# Altium schematic sheet BW1097_Power_Supply.SchDoc: =project_title (part 2 of 3)
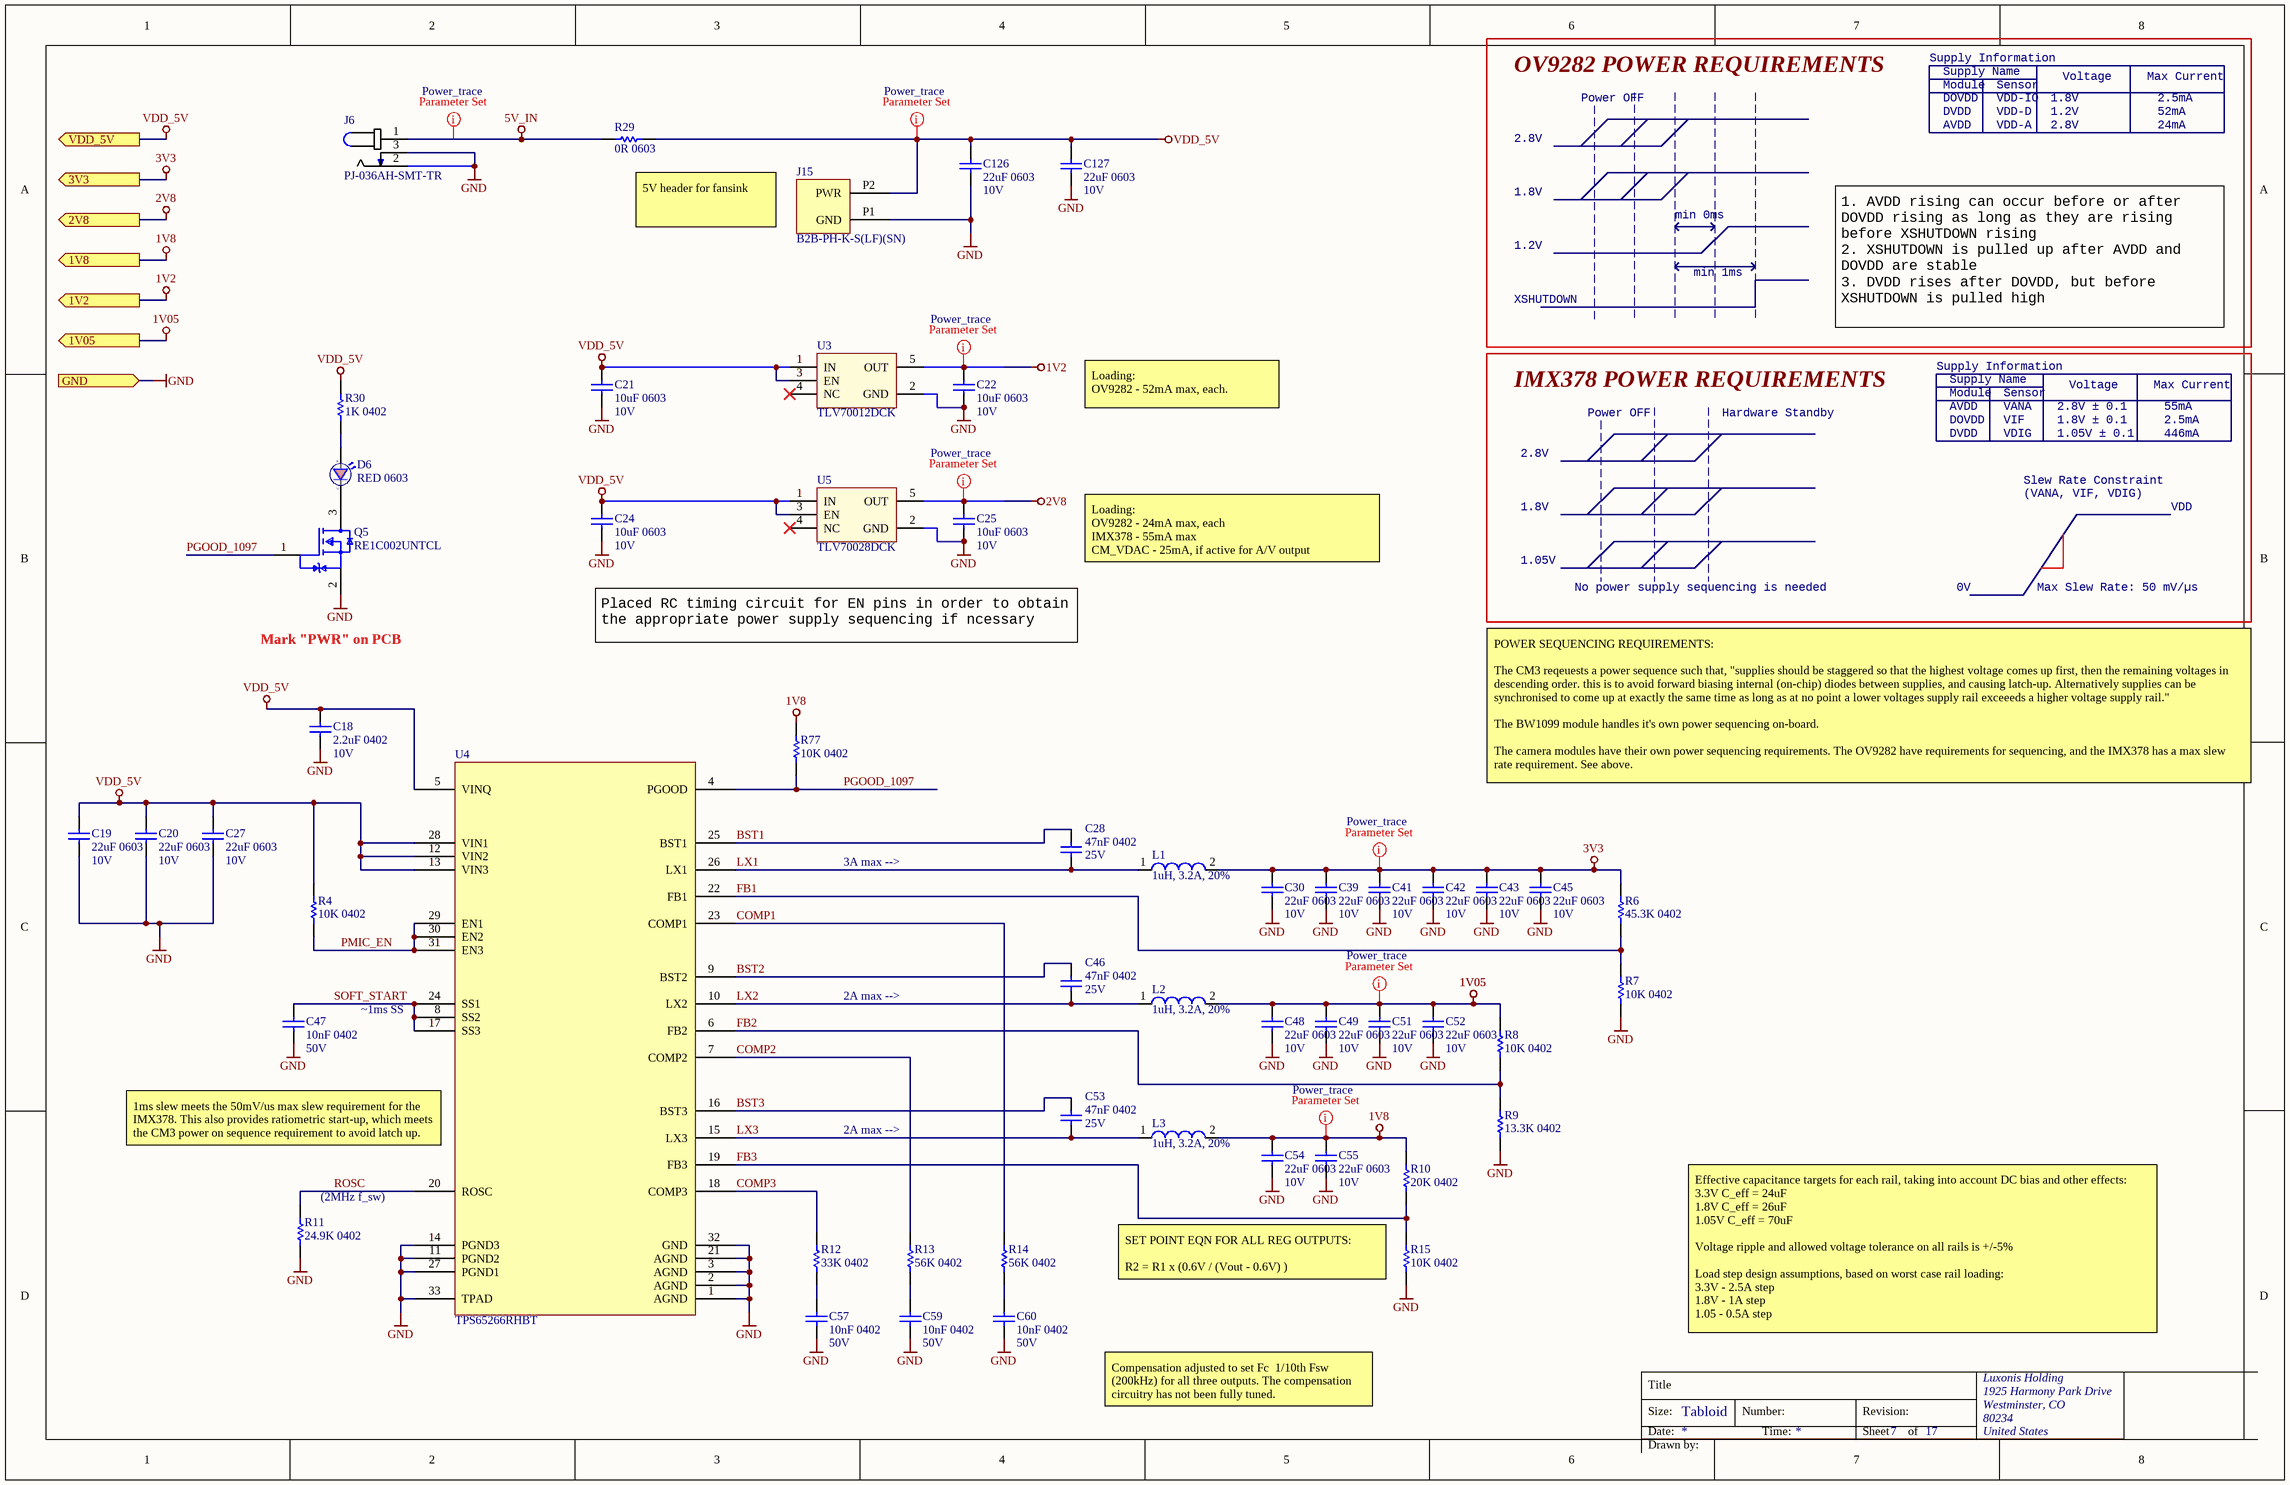
[diagram p1: BW1097_Power_Supply.SchDoc]
## Library data of the parts
C18 = GRM155R61A225KE95D: CAP CER 2.2UF 10V X5R 0402 10%; Manufacturer 1: Murata; Material: Ceramic; Manufacturer Part Number 1: GRM155R61A225KE95D; Supplier 1: Digi-Key; Stock 1: 1453518; Pricing 1: 1=0.13000, 10=0.09000, 100=0.04250, 500=0.02982, 1000=0.02469, 2500=0.02298, 5000=0.02103 (USD); RoHS: Yes; Mount: Surface Mount; Case/Package: 0402; Weight: 0.000212oz; Case Code (Metric): 1005; Case Code (Imperial): 0402; Min Operating Temperature: -55°C; Max Operating Temperature: 85°C; Capacitance: 2.2uF; Tolerance: 10%; Packaging: Tape and Reel; Dielectric: X5R; Termination: SMD/SMT; Voltage Rating (DC): 10V; Package Quantity: 10000; Length: 1mm; Height: 0.5mm; Width: 0.5mm; Thickness: 0.022inch; Depth: 0.5mm; REACH SVHC: No SVHC; Lead Free: Lead Free; ComponentLink1URL: http://www.mouser.com/ds/2/281/c02e-2905.pdf?src-supplier=Mouser; ComponentLink1Description: http://www.mouser.com/ds/2/281/c02e-2905.pdf?src-supplier=Mouser; ComponentLink2URL: http://components.arrow.com/part/dataview/0323_04264073?src-supplier=Arrow+Europe; ComponentLink2Description: http://components.arrow.com/part/dataview/0323_04264073?src-supplier=Arrow+Europe; ComponentLink3URL: http://www.farnell.com/datasheets/1872202.pdf?src-supplier=Farnell; ComponentLink3Description: http://www.farnell.com/datasheets/1872202.pdf?src-supplier=Farnell; ComponentLink4URL: http://www.farnell.com/datasheets/2047915.pdf?src-supplier=Farnell; ComponentLink4Description: http://www.farnell.com/datasheets/2047915.pdf?src-supplier=Farnell; ComponentLink5URL: http://www.farnell.com/datasheets/1872202.pdf?src-supplier=Element14; ComponentLink5Description: http://www.farnell.com/datasheets/1872202.pdf?src-supplier=Element14; ComponentLink6URL: http://psearch.en.murata.com/capacitor/product/GRM155R61A225KE95%23.pdf?src-supplier=Avnet; ComponentLink6Description: http://psearch.en.murata.com/capacitor/product/GRM155R61A225KE95%23.pdf?src-supplier=Avnet; ComponentLink7URL: http://www.farnell.com/datasheets/2047915.pdf?src-supplier=Element14; ComponentLink7Description: http://www.farnell.com/datasheets/2047915.pdf?src-supplier=Element14; ComponentLink8URL: https://search.murata.co.jp/Ceramy/image/img/A01X/G101/ENG/GRM155R61A225KE95-01.pdf?src-supplier=Digi-Key; ComponentLink8Description: https://search.murata.co.jp/Ceramy/image/img/A01X/G101/ENG/GRM155R61A225KE95-01.pdf?src-supplier=Digi-Key; ComponentLink9URL: http://www.farnell.com/datasheets/2047915.pdf?src-supplier=Newark; ComponentLink9Description: http://www.farnell.com/datasheets/2047915.pdf?src-supplier=Newark; Supplier Part Number 1: 490-10451-1-ND
C19 C20 C27 C30 C39 C41-C43 C45 C48 C49 C51 C52 C54 C55 C126 C127 = GRM188R61A226ME15D: CAP CER 22UF 10V X5R 0603 20%; Manufacturer 1: Murata; Material: Ceramic; Manufacturer Part Number 1: GRM188R61A226ME15D; ComponentLink1URL: https://datasheet.ciiva.com/46444/1769893-46444975.pdf?src-supplier=Element14; ComponentLink1Description: https://datasheet.ciiva.com/46444/1769893-46444975.pdf?src-supplier=Element14; Supplier 1: Digi-Key; Stock 1: 984716; Pricing 1: 1=0.31000, 10=0.21500, 100=0.12160, 500=0.08584, 1000=0.07512 (USD); RoHS: Yes; Mount: Surface Mount; Case/Package: 0603; Weight: 0.000222oz; Case Code (Metric): 1608; Case Code (Imperial): 0603; Min Operating Temperature: -55°C; Max Operating Temperature: 85°C; Capacitance: 22uF; Tolerance: 20%; Packaging: Tape and Reel; Dielectric: X5R; Voltage Rating (DC): 10V; Termination: SMD/SMT; Package Quantity: 4000; Length: 1.6mm; Height: 0.8mm; Width: 0.8mm; Thickness: 0.039inch; Depth: 0.8mm; REACH SVHC: No SVHC; Lead Free: Lead Free; Supplier Part Number 1: 490-10476-1-ND
C21 C22 C24 C25 = GRM188R61A106ME69D: CAP CER 10UF 10V X5R 0603 20%; Manufacturer 1: Murata; Material: Ceramic; Manufacturer Part Number 1: GRM188R61A106ME69D; Supplier 1: Digi-Key; Stock 1: 2873098; Pricing 1: 1=0.21000, 10=0.14100, 100=0.07130, 500=0.04876, 1000=0.04313 (USD); RoHS: Yes; Mount: Surface Mount; Case/Package: 0603; Weight: 0.000222oz; Case Code (Metric): 1608; Case Code (Imperial): 0603; Min Operating Temperature: -55°C; Max Operating Temperature: 85°C; Packaging: Tape and Reel; Tolerance: 20%; Capacitance: 10uF; Dielectric: X5R; Voltage Rating (DC): 10V; Package Quantity: 4000; Termination: SMD/SMT; Length: 1.6mm; Height: 0.8mm; Width: 0.8mm; Thickness: 0.035inch; Depth: 0.8mm; REACH SVHC: Unknown; Lead Free: Lead Free; ComponentLink1URL: http://www.mouser.com/ds/2/281/c02e-2905.pdf?src-supplier=Mouser; ComponentLink1Description: http://www.mouser.com/ds/2/281/c02e-2905.pdf?src-supplier=Mouser; ComponentLink2URL: http://components.arrow.com/part/dataview/0323_06119472?src-supplier=Arrow+Europe; ComponentLink2Description: http://components.arrow.com/part/dataview/0323_06119472?src-supplier=Arrow+Europe; ComponentLink3URL: http://www.farnell.com/datasheets/2048014.pdf?src-supplier=Farnell; ComponentLink3Description: http://www.farnell.com/datasheets/2048014.pdf?src-supplier=Farnell; ComponentLink4URL: http://www.farnell.com/datasheets/1872210.pdf?src-supplier=Farnell; ComponentLink4Description: http://www.farnell.com/datasheets/1872210.pdf?src-supplier=Farnell; ComponentLink5URL: http://search.murata.co.jp/Ceramy/image/img/A01X/G101/ENG/GRM188R61A106ME69-01.pdf?src-supplier=Digi-Key; ComponentLink5Description: http://search.murata.co.jp/Ceramy/image/img/A01X/G101/ENG/GRM188R61A106ME69-01.pdf?src-supplier=Digi-Key; ComponentLink6URL: http://www.farnell.com/datasheets/1872210.pdf?src-supplier=Newark; ComponentLink6Description: http://www.farnell.com/datasheets/1872210.pdf?src-supplier=Newark; ComponentLink7URL: http://www.farnell.com/datasheets/2048014.pdf?src-supplier=Element14; ComponentLink7Description: http://www.farnell.com/datasheets/2048014.pdf?src-supplier=Element14; ComponentLink8URL: http://www.farnell.com/datasheets/2048014.pdf?src-supplier=Newark; ComponentLink8Description: http://www.farnell.com/datasheets/2048014.pdf?src-supplier=Newark; Supplier Part Number 1: 490-10475-1-ND
C28 C46 C53 = GRM155R71E473KA88D: CAP CER 0.047UF 25V X7R 0402 10%; Manufacturer 1: Murata; Material: Ceramic; Manufacturer Part Number 1: GRM155R71E473KA88D; Manufacturer: Murata; Manufacturer Part Number: GRM155R71E473KA88D; RoHS: Yes; Mount: Surface Mount; Case/Package: 0402; Number of Pins: 2; Case Code (Metric): 1005; Case Code (Imperial): 0402; Min Operating Temperature: -55°C; Max Operating Temperature: 125°C; Capacitance: 47nF; Tolerance: 10%; Packaging: Tape and Reel; Dielectric: X7R; Voltage Rating (DC): 25V; Package Quantity: 1; Termination: SMD/SMT; Voltage Rating: 25V; Length: 1mm; Height: 0.5mm; Width: 0.02inch; Depth: 0.5mm; Thickness: 0.022inch; Radiation Hardening: No; Lead Free: Lead Free; REACH SVHC: No SVHC; ComponentLink1URL: https://datasheet.ciiva.com/17455/product-17455616.pdf?src-supplier=Avnet+Europe; ComponentLink1Description: https://datasheet.ciiva.com/17455/product-17455616.pdf?src-supplier=Avnet+Europe; ComponentLink2URL: https://datasheet.ciiva.com/131/grm155r71e473ka88-01-131494.pdf?src-supplier=Digi-Key; ComponentLink2Description: https://datasheet.ciiva.com/131/grm155r71e473ka88-01-131494.pdf?src-supplier=Digi-Key; ComponentLink3URL: https://datasheet.ciiva.com/34302/1856425-34302854.pdf?src-supplier=Jameco; ComponentLink3Description: https://datasheet.ciiva.com/34302/1856425-34302854.pdf?src-supplier=Jameco; ComponentLink4URL: https://datasheet.ciiva.com/18184/getdatasheetpartid-153136-18184712.pdf?src-supplier=Verical; ComponentLink4Description: https://datasheet.ciiva.com/18184/getdatasheetpartid-153136-18184712.pdf?src-supplier=Verical; ComponentLink5URL: https://datasheet.ciiva.com/29199/454180-da-01-en-vs-kondensator-0402-29199826.pdf?src-supplier=Conrad; ComponentLink5Description: https://datasheet.ciiva.com/29199/454180-da-01-en-vs-kondensator-0402-29199826.pdf?src-supplier=Conrad; ComponentLink6URL: https://datasheet.ciiva.com/2989/product-2989395.pdf?src-supplier=Avnet; ComponentLink6Description: https://datasheet.ciiva.com/2989/product-2989395.pdf?src-supplier=Avnet; ComponentLink7URL: https://datasheet.ciiva.com/131/grm155r71e473ka88-01-131492.pdf?src-supplier=Digi-Key; ComponentLink7Description: https://datasheet.ciiva.com/131/grm155r71e473ka88-01-131492.pdf?src-supplier=Digi-Key; ComponentLink8URL: https://datasheet.ciiva.com/131/grm155r71e473ka88-01-131493.pdf?src-supplier=Digi-Key; ComponentLink8Description: https://datasheet.ciiva.com/131/grm155r71e473ka88-01-131493.pdf?src-supplier=Digi-Key; ComponentLink9URL: https://datasheet.ciiva.com/7937/608985-7937623.pdf?src-supplier=Element14; ComponentLink9Description: https://datasheet.ciiva.com/7937/608985-7937623.pdf?src-supplier=Element14; ComponentLink10URL: https://datasheet.ciiva.com/14103/grmseries-highdielectrictype-eng-14103754.pdf?src-supplier=Distrelec; ComponentLink10Description: https://datasheet.ciiva.com/14103/grmseries-highdielectrictype-eng-14103754.pdf?src-supplier=Distrelec; ComponentLink11URL: https://datasheet.ciiva.com/5424/product-5424844.pdf?src-supplier=Mouser; ComponentLink11Description: https://datasheet.ciiva.com/5424/product-5424844.pdf?src-supplier=Mouser; ComponentLink12URL: https://datasheet.ciiva.com/16213/product-16213823.pdf?src-supplier=Future+Electronics; ComponentLink12Description: https://datasheet.ciiva.com/16213/product-16213823.pdf?src-supplier=Future+Electronics; Supplier 1: Digi-Key; Stock 1: 1130633; Pricing 1: 1=0.10000, 10=0.06300, 100=0.02820, 500=0.02012, 1000=0.01581, 2500=0.01438, 5000=0.01323 (USD); Supplier Part Number 1: 490-3254-1-ND
C47 C57 C59 C60 = GRM155R71H103KA88D: CAP CER 10000PF 50V X7R 0402; Manufacturer 1: Murata; Material: Ceramic; Tolerance: 10%; Voltage: 25V; Manufacturer Part Number 1: GRM155R71H103KA88D; Supplier 1: Digi-Key; Stock 1: 6923572; Pricing 1: 1=0.10000, 10=0.03800, 100=0.01690, 500=0.01208, 1000=0.00949, 2500=0.00862, 5000=0.00794 (USD); RoHS: Yes; Mount: Surface Mount; Case/Package: 0402; Number of Pins: 2; Case Code (Metric): 1005; Case Code (Imperial): 0402; Min Operating Temperature: -55°C; Max Operating Temperature: 125°C; Capacitance: 10nF; Packaging: Tape and Reel; Termination: SMD/SMT; Voltage Rating (DC): 50V; Package Quantity: 1; Dielectric: X7R; Length: 1mm; Height: 0.5mm; Width: 0.02inch; Thickness: 0.022inch; Depth: 0.5mm; Radiation Hardening: No; REACH SVHC: No SVHC; Lead Free: Lead Free; ComponentLink1URL: https://datasheet.ciiva.com/129/product-129810.pdf?src-supplier=Digi-Key; ComponentLink1Description: https://datasheet.ciiva.com/129/product-129810.pdf?src-supplier=Digi-Key; ComponentLink2URL: https://datasheet.ciiva.com/19476/1856433-19476546.pdf?src-supplier=Jameco; ComponentLink2Description: https://datasheet.ciiva.com/19476/1856433-19476546.pdf?src-supplier=Jameco; ComponentLink3URL: https://datasheet.ciiva.com/11786/0900766b80ef921d-11786340.pdf?src-supplier=RSComponents; ComponentLink3Description: https://datasheet.ciiva.com/11786/0900766b80ef921d-11786340.pdf?src-supplier=RSComponents; ComponentLink4URL: https://datasheet.ciiva.com/18100/getdatasheetpartid-27434-18100660.pdf?src-supplier=Verical; ComponentLink4Description: https://datasheet.ciiva.com/18100/getdatasheetpartid-27434-18100660.pdf?src-supplier=Verical; ComponentLink5URL: https://datasheet.ciiva.com/22698/1747449-22698420.pdf?src-supplier=Element14; ComponentLink5Description: https://datasheet.ciiva.com/22698/1747449-22698420.pdf?src-supplier=Element14; ComponentLink6URL: https://datasheet.ciiva.com/29199/454225-da-01-en-vs-kondensator-0402-29199740.pdf?src-supplier=Conrad; ComponentLink6Description: https://datasheet.ciiva.com/29199/454225-da-01-en-vs-kondensator-0402-29199740.pdf?src-supplier=Conrad; ComponentLink7URL: https://datasheet.ciiva.com/129/grm155r71h103ka88-01-129811.pdf?src-supplier=Digi-Key; ComponentLink7Description: https://datasheet.ciiva.com/129/grm155r71h103ka88-01-129811.pdf?src-supplier=Digi-Key; ComponentLink8URL: https://datasheet.ciiva.com/129/grm155r71h103ka88-01-129812.pdf?src-supplier=Digi-Key; ComponentLink8Description: https://datasheet.ciiva.com/129/grm155r71h103ka88-01-129812.pdf?src-supplier=Digi-Key; ComponentLink9URL: https://datasheet.ciiva.com/16495/product-16495290.pdf?src-supplier=Future+Electronics; ComponentLink9Description: https://datasheet.ciiva.com/16495/product-16495290.pdf?src-supplier=Future+Electronics; ComponentLink10URL: https://datasheet.ciiva.com/5410/product-5410990.pdf?src-supplier=Mouser; ComponentLink10Description: https://datasheet.ciiva.com/5410/product-5410990.pdf?src-supplier=Mouser; Supplier 2: Mouser; Supplier 3: Arrow; Supplier Part Number 1: 490-4516-1-ND; Supplier Part Number 2: 81-GRM155R71H103KA8D; Supplier Part Number 3: GRM155R71H103KA88D
D6 = SML-D12U8WT86: LED RED DIFFUSED 0603 SMD Red 620nm LED Indication - Discrete 2.2V 0603 (1608 Metric); Manufacturer 1: Rohm; Lens Style: Rectangular,Diffused,Colorless; Forward Current: 20mA; Luminous Intensity: 63mcd; Number of LEDs: 1; Viewing Angle: 160°; Lens Color: White,Clear,Diffused; Supplier 1: Digi-Key; Stock 1: 63748; Pricing 1: 1=0.33000, 10=0.23900, 100=0.11340, 500=0.07560, 1000=0.05922 (USD); Mount: Surface Mount; Case/Package: 0603; Number of Pins: 2; Case Code (Metric): 1608; Case Code (Imperial): 0603; Min Operating Temperature: -40°C; Max Operating Temperature: 85°C; Forward Voltage: 2.2V; Packaging: Tape and Reel; Dominant Wavelength: 620nm; Wavelength: 620nm; Package Quantity: 1; Test Current: 20mA; Lens Transparency: Diffused; Length: 1.6mm; Height: 0.65mm; Width: 0.8mm; Radiation Hardening: No; REACH SVHC: No SVHC; Lead Free: Lead Free; ComponentLink1URL: https://datasheet.ciiva.com/11774/0900766b80df3ada-11774020.pdf?src-supplier=RSComponents; ComponentLink1Description: https://datasheet.ciiva.com/11774/0900766b80df3ada-11774020.pdf?src-supplier=RSComponents; ComponentLink2URL: https://datasheet.ciiva.com/2110/sml-d1-2110375.pdf?src-supplier=Digi-Key; ComponentLink2Description: https://datasheet.ciiva.com/2110/sml-d1-2110375.pdf?src-supplier=Digi-Key; ComponentLink3URL: https://datasheet.ciiva.com/2110/sml-d1-2110376.pdf?src-supplier=Digi-Key; ComponentLink3Description: https://datasheet.ciiva.com/2110/sml-d1-2110376.pdf?src-supplier=Digi-Key; ComponentLink4URL: https://datasheet.ciiva.com/2110/sml-d1-2110377.pdf?src-supplier=Digi-Key; ComponentLink4Description: https://datasheet.ciiva.com/2110/sml-d1-2110377.pdf?src-supplier=Digi-Key; ComponentLink5URL: https://datasheet.ciiva.com/9324/sml-d1-9324826.pdf?src-supplier=Avnet; ComponentLink5Description: https://datasheet.ciiva.com/9324/sml-d1-9324826.pdf?src-supplier=Avnet; RoHS: Yes; Color: Red; Illumination Color: Red; ComponentLink6URL: https://datasheet.ciiva.com/17420/sml-d1-17420939.pdf?src-supplier=Avnet+Europe; ComponentLink6Description: https://datasheet.ciiva.com/17420/sml-d1-17420939.pdf?src-supplier=Avnet+Europe; Supplier Part Number 1: 511-1580-1-ND; Manufacturer Part Number 1: SML-D12U8WT86
J6 = PJ-036AH-SMT-TR: CONN PWR JACK 2X5.5MM SOLDER; Manufacturer 1: CUI; Current Rating: 5A; Gender: Male; Shielding: Unshielded; Voltage Rating: 24V; Insulation Resistance: 100MR; Number of Conductors: 2; Supplier 1: Digi-Key; Manufacturer Part Number 1: PJ-036AH-SMT-TR; Stock 1: 14194; Pricing 1: 1=1.39000, 10=1.26100, 25=1.18400, 50=1.13260, 100=1.08110 (USD); RoHS: Yes; Mount: Surface Mount; Case/Package: SMD/SMT; Color: Black; Contact Material: Brass; Contact Plating: Silver; Housing Color: Black; Housing Material: Thermoplastic; Min Operating Temperature: -25°C; Max Operating Temperature: 85°C; Package Quantity: 1000; Termination: SMD/SMT; Connector Type: Jack; Contact Gender: Male; Packaging: Tape and Reel; Orientation: Horizontal; Lead Free: Lead Free; Flammability Rating: UL94 V-0; ComponentLink1URL: http://www.mouser.com/ds/2/670/pj-036ah-smt-516063.pdf?src-supplier=Mouser; ComponentLink1Description: http://www.mouser.com/ds/2/670/pj-036ah-smt-516063.pdf?src-supplier=Mouser; ComponentLink2URL: http://www.cui.com/Product/Resource/FuturePDF/PJ-036AH-SMT.pdf?src-supplier=Future+Electronics; ComponentLink2Description: http://www.cui.com/Product/Resource/FuturePDF/PJ-036AH-SMT.pdf?src-supplier=Future+Electronics; ComponentLink3URL: https://www.cui.com/product/resource/digikeypdf/pj-036ah-smt-tr.pdf?src-supplier=Digi-Key; ComponentLink3Description: https://www.cui.com/product/resource/digikeypdf/pj-036ah-smt-tr.pdf?src-supplier=Digi-Key; Supplier Part Number 1: CP-036AHPJCT-ND; Supplier 2: Mouser; Manufacturer 2: CUI; Manufacturer Part Number 2: PJ-036AH-SMT-TR; Stock 2: 2079; Pricing 2: 1=1.36000, 10=1.20000, 25=1.13000, 50=1.08000, 100=1.03000, 200=0.93600, 400=0.84300, 1000=0.74900, 2400=0.67900, 10000=0.67900 (USD); ComponentLink4URL: http://datasheet.octopart.com/PJ-036AH-SMT-TR-CUI-datasheet-100142517.pdf?src-supplier=CUI; ComponentLink4Description: http://datasheet.octopart.com/PJ-036AH-SMT-TR-CUI-datasheet-100142517.pdf?src-supplier=CUI; ComponentLink5URL: http://datasheet.octopart.com/PJ-036AH-SMT-TR-CUI-datasheet-103764787.pdf?src-supplier=CUI; ComponentLink5Description: http://datasheet.octopart.com/PJ-036AH-SMT-TR-CUI-datasheet-103764787.pdf?src-supplier=CUI; ComponentLink6URL: http://datasheet.octopart.com/PJ-036AH-SMT-TR-CUI-datasheet-103110338.pdf?src-supplier=Electro+Sonic; ComponentLink6Description: http://datasheet.octopart.com/PJ-036AH-SMT-TR-CUI-datasheet-103110338.pdf?src-supplier=Electro+Sonic; ComponentLink7URL: http://datasheet.octopart.com/PJ-036AH-SMT-TR-CUI-datasheet-13308170.pdf?src-supplier=Future+Electronics; ComponentLink7Description: http://datasheet.octopart.com/PJ-036AH-SMT-TR-CUI-datasheet-13308170.pdf?src-supplier=Future+Electronics; ComponentLink8URL: http://datasheet.octopart.com/PJ-036AH-SMT-TR-CUI-datasheet-98439734.pdf?src-supplier=Future+Electronics; ComponentLink8Description: http://datasheet.octopart.com/PJ-036AH-SMT-TR-CUI-datasheet-98439734.pdf?src-supplier=Future+Electronics; ComponentLink9URL: http://datasheet.octopart.com/PJ-036AH-SMT-TR-CUI-datasheet-100337374.pdf?src-supplier=Future+Electronics; ComponentLink9Description: http://datasheet.octopart.com/PJ-036AH-SMT-TR-CUI-datasheet-100337374.pdf?src-supplier=Future+Electronics; ComponentLink10URL: http://datasheet.octopart.com/PJ-036AH-SMT-TR-CUI-datasheet-102985011.pdf?src-supplier=Future+Electronics; ComponentLink10Description: http://datasheet.octopart.com/PJ-036AH-SMT-TR-CUI-datasheet-102985011.pdf?src-supplier=Future+Electronics; Supplier Part Number 2: 490-PJ-036AH-SMT-TR
J15 = B2B-PH-K-S(LF)(SN): CONN HEADER VERT 2POS 2MM; Manufacturer 1: JST; Number of Positions: 2; Connector Type: Male Pin; Current Rating: 2A; Gender: Male; Contact Resistance: 20mR; Insulation Resistance: 1MR; Voltage Rating: 100V; Supplier 1: Digi-Key; Stock 1: 216199; Pricing 1: 1 = 0.170000, 10 = 0.162000, 100 = 0.100200, 500 = 0.082880, 1000 = 0.072520, 5000 = 0.062160, 10000 = 0.060440 (USD); RoHS: Yes; Mount: Through Hole; Number of Pins: 2; Contact Plating: Tin; Color: Natural; Contact Material: Brass; Housing Material: Polyamide; Housing Color: White; Min Operating Temperature: -25°C; Max Operating Temperature: 85°C; Number of Rows: 1; Packaging: Bulk; Termination: Solder; Fastening Type: Detent; Number of Poles: 2; Number of Contacts: 2; Orientation: Straight; Max Current Rating: 2A; Max Voltage Rating (AC): 100V; Voltage Rating (AC): 100V; Working Voltage: 100V; Max Voltage Rating (DC): 100V; Length: 5.9mm; Height: 9.4mm; Pitch: 2mm; Width: 4.5mm; Contact Mating Length: 0.13inch; Depth: 4.5mm; Lead Pitch: 2mm; Lead Free: Lead Free; REACH SVHC: No SVHC; ComponentLink1URL: https://datasheet.ciiva.com/6747/80560-6747392.pdf?src-supplier=Newark; ComponentLink1Description: https://datasheet.ciiva.com/6747/80560-6747392.pdf?src-supplier=Newark; ComponentLink2URL: https://datasheet.ciiva.com/11746/0900766b8082f551-11746676.pdf?src-supplier=RSComponents; ComponentLink2Description: https://datasheet.ciiva.com/11746/0900766b8082f551-11746676.pdf?src-supplier=RSComponents; ComponentLink3URL: https://datasheet.ciiva.com/8052/80560-8052022.pdf?src-supplier=Element14; ComponentLink3Description: https://datasheet.ciiva.com/8052/80560-8052022.pdf?src-supplier=Element14; ComponentLink4URL: https://datasheet.ciiva.com/712/eph-712442.pdf?src-supplier=Digi-Key; ComponentLink4Description: https://datasheet.ciiva.com/712/eph-712442.pdf?src-supplier=Digi-Key; ComponentLink5URL: https://datasheet.ciiva.com/16422/b2b-ph-k-slfsn-16422715.pdf?src-supplier=Future+Electronics; ComponentLink5Description: https://datasheet.ciiva.com/16422/b2b-ph-k-slfsn-16422715.pdf?src-supplier=Future+Electronics; Supplier Part Number 1: 455-1704-ND; Manufacturer Part Number 1: B2B-PH-K-S(LF)(SN)
L1-L3 = DFE252012P-1R0M=P2: FIXED IND 1UH 3.2A 42 MOHM SMD; Manufacturer 1: Murata; Core Material: Ferrite; Current Rating: 4.3A; Shielding: Shielded; Test Frequency: 1MHz; DC Resistance (DCR): 42mR; Manufacturer Part Number 1: DFE252012P-1R0M=P2; Manufacturer: Murata; Manufacturer Part Number: DFE252012P-1R0M=P2; RoHS: Yes; Mount: Surface Mount; Case/Package: 1008; Case Code (Metric): 2520; Min Operating Temperature: -40°C; Max Operating Temperature: 125°C; Packaging: Tape and Reel; Composition: Wirewound; Length: 0.098inch; Width: 0.079inch; Height - Seated (Max): 0.039inch; Depth: 2mm; ComponentLink1URL: http://www.farnell.com/datasheets/2550134.pdf?src-supplier=Farnell; ComponentLink1Description: http://www.farnell.com/datasheets/2550134.pdf?src-supplier=Farnell; ComponentLink2URL: https://www.murata.com/~/media/webrenewal/products/inductor/chip/tokoproducts/wirewoundmetalalloychiptype/m_dfe252012p.ashx?src-supplier=Digi-Key; ComponentLink2Description: https://www.murata.com/~/media/webrenewal/products/inductor/chip/tokoproducts/wirewoundmetalalloychiptype/m_dfe252012p.ashx?src-supplier=Digi-Key; ComponentLink3URL: http://www.murata.com/~/media/webrenewal/products/inductor/chip/tokoproducts/wirewoundmetalalloychiptype/m_dfe252012p.ashx?src-supplier=Digi-Key; ComponentLink3Description: http://www.murata.com/~/media/webrenewal/products/inductor/chip/tokoproducts/wirewoundmetalalloychiptype/m_dfe252012p.ashx?src-supplier=Digi-Key; ComponentLink4URL: http://www.toko.co.jp/products/pdf/inductors/dfe252012p.pdf?src-supplier=Avnet; ComponentLink4Description: http://www.toko.co.jp/products/pdf/inductors/dfe252012p.pdf?src-supplier=Avnet; Supplier 1: Digi-Key; Stock 1: 2560; Pricing 1: 1=0.43000, 10=0.37800, 100=0.27030, 500=0.22702, 1000=0.18377 (USD); Supplier Part Number 1: 490-10647-1-ND; Max DC Current: 3.2A; Tolerance: 20%; Case Code (Imperial): 1008; Supplier 2: Digi-Key; Manufacturer 2: Murata; Manufacturer Part Number 2: DFE252012P-1R0M=P2; Stock 2: 95; Pricing 2: 1=0.43000, 10=0.37800, 100=0.27030, 500=0.22702, 1000=0.18377 (USD); Supplier 3: Mouser; Manufacturer 3: Murata; Manufacturer Part Number 3: DFE252012P-1R0M=P2; Stock 3: 667; Pricing 3: 1=0.43000, 10=0.37900, 50=0.37900, 100=0.27000, 1000=0.18400, 10000=0.14600 (USD); Supplier 4: Element14; Manufacturer 4: Murata; Manufacturer Part Number 4: DFE252012P-1R0M=P2; Stock 4: 41; Pricing 4: 1=0.64000, 10=0.56500, 100=0.40500, 500=0.34000, 1000=0.27500 (SGD); Supplier Part Number 4: 2530071; Supplier Part Number 3: 81-DFE252012P-1R0MP2; Supplier Part Number 2: 490-10647-6-ND; Inductance: 1uH
Q5 = RE1C002UNTCL: MOSFET N-CH 20V 0.2A EMT3; Manufacturer 1: Rohm; Continuous Drain Current (ID): 200mA; Rds On Max: 1.2R; Input Capacitance: 25pF; Max Power Dissipation: 150mW; Manufacturer Part Number 1: RE1C002UNTCL; RoHS: Yes; Mount: Surface Mount; Case/Package: SOT-89; Packaging: Tape and Reel; Drain to Source Voltage (Vdss): 20V; Lead Free: Lead Free; ComponentLink1URL: http://www.mouser.com/ds/2/348/re1c002untcl-e-1018231.pdf?src-supplier=Mouser; ComponentLink1Description: http://www.mouser.com/ds/2/348/re1c002untcl-e-1018231.pdf?src-supplier=Mouser; ComponentLink2URL: http://rohmfs.rohm.com/en/techdata_basic/transistor/taping/EMT3_TL_taping.pdf?src-supplier=Digi-Key; ComponentLink2Description: http://rohmfs.rohm.com/en/techdata_basic/transistor/taping/EMT3_TL_taping.pdf?src-supplier=Digi-Key; ComponentLink3URL: http://rohmfs.rohm.com/en/products/databook/datasheet/discrete/transistor/mosfet/re1c002un.pdf?src-supplier=Avnet; ComponentLink3Description: http://rohmfs.rohm.com/en/products/databook/datasheet/discrete/transistor/mosfet/re1c002un.pdf?src-supplier=Avnet; ComponentLink4URL: https://www.rohm.com/datasheet/RE1C002UN/re1c002untcl-e?src-supplier=Digi-Key; ComponentLink4Description: https://www.rohm.com/datasheet/RE1C002UN/re1c002untcl-e?src-supplier=Digi-Key; ComponentLink5URL: http://www.farnell.com/datasheets/2704376.pdf?src-supplier=Newark; ComponentLink5Description: http://www.farnell.com/datasheets/2704376.pdf?src-supplier=Newark; ComponentLink6URL: http://www.farnell.com/datasheets/2704376.pdf?src-supplier=Farnell; ComponentLink6Description: http://www.farnell.com/datasheets/2704376.pdf?src-supplier=Farnell; ComponentLink7URL: http://www.farnell.com/datasheets/2704376.pdf?src-supplier=Element14; ComponentLink7Description: http://www.farnell.com/datasheets/2704376.pdf?src-supplier=Element14; Supplier 1: Digi-Key; Stock 1: 868886; Pricing 1: 1=0.20000, 10=0.18200, 100=0.09930, 500=0.06112, 1000=0.04167 (USD); Supplier Part Number 1: RE1C002UNTCLCT-ND
R4 R7 R8 R15 R77 = RC0402FR-1310KL: RES SMD 10K OHM 1% 0402 1/16W Chip Resistor, 0402 [1005 Metric], 10 kohm, RC Series, 50 V, Thick Film, 62.5 mW; Manufacturer 1: Yageo; Resistance: 10kR; Temperature Coefficient: 100ppm/°C; Power Rating: 62.5mW; Voltage Rating: 50V; Manufacturer Part Number 1: RC0402FR-1310KL; ComponentLink1URL: https://datasheet.ciiva.com/16940/pyu-rc0402-51-rohs-l-6-16940293.pdf?src-supplier=Avnet+Europe; ComponentLink1Description: https://datasheet.ciiva.com/16940/pyu-rc0402-51-rohs-l-6-16940293.pdf?src-supplier=Avnet+Europe; ComponentLink2URL: https://datasheet.ciiva.com/28386/pyu-rc0402-51-rohs-l-6-28386855.pdf?src-supplier=Avnet+Europe; ComponentLink2Description: https://datasheet.ciiva.com/28386/pyu-rc0402-51-rohs-l-6-28386855.pdf?src-supplier=Avnet+Europe; ComponentLink3URL: https://datasheet.ciiva.com/16740/pyu-rc0402-51-rohs-l-6-r-16740602.pdf?src-supplier=Future+Electronics; ComponentLink3Description: https://datasheet.ciiva.com/16740/pyu-rc0402-51-rohs-l-6-r-16740602.pdf?src-supplier=Future+Electronics; ComponentLink4URL: https://datasheet.ciiva.com/8891/pyu-rc0402-51-rohs-l-6-8891339.pdf?src-supplier=Avnet; ComponentLink4Description: https://datasheet.ciiva.com/8891/pyu-rc0402-51-rohs-l-6-8891339.pdf?src-supplier=Avnet; ComponentLink5URL: https://datasheet.ciiva.com/5557/pyu-rc0402-51-rohs-l-6-r-5557997.pdf?src-supplier=Mouser; ComponentLink5Description: https://datasheet.ciiva.com/5557/pyu-rc0402-51-rohs-l-6-r-5557997.pdf?src-supplier=Mouser; ComponentLink6URL: https://datasheet.ciiva.com/7983/1018594-7983533.pdf?src-supplier=Element14; ComponentLink6Description: https://datasheet.ciiva.com/7983/1018594-7983533.pdf?src-supplier=Element14; Supplier 1: Newark; Stock 1: 62239; Pricing 1: 1=0.10000, 25=0.01200, 100=0.00400, 250=0.00400, 500=0.00300, 1000=0.00300 (USD); RoHS: Yes; Case/Package: 0402; Number of Pins: 2; Contact Plating: Tin,Matte,Lead; Case Code (Imperial): 0402; Case Code (Metric): 1005; Min Operating Temperature: -55°C; Max Operating Temperature: 155°C; Tolerance: 1%; Composition: Thick Film; Packaging: Tape and Reel; Termination: SMD/SMT; Military Standard: Not; Voltage Rating (DC): 50V; Working Voltage: 50V; Number of Terminations: 2; Length: 1mm; Depth: 0.5mm; Radiation Hardening: No; REACH SVHC: No SVHC; Lead Free: Lead Free; Supplier Part Number 1: 67R9960; Supplier 2: Future Electronics; Supplier 3: Mouser; Supplier 4: Element14; Supplier Part Number 2: RC0402FR-1310KL-CUTT; Supplier Part Number 3: 603-RC0402FR-1310KL; Supplier Part Number 4: 1799235
R6 = RC0402FR-0745K3L: RES SMD 45.3K OHM 1% 1/16W 0402; Manufacturer 1: Yageo; Resistance: 45.3kR; Temperature Coefficient: 100ppm/°C; Power Rating: 62.5mW; Voltage Rating: 50V; Max Power Dissipation: 63mW; Manufacturer Part Number 1: RC0402FR-0745K3L; Supplier 1: Digi-Key; Stock 1: 1784936; Pricing 1: 1=0.10000, 10=0.01600, 100=0.00640, 1000=0.00289, 2500=0.00251, 5000=0.00207 (USD); RoHS: Yes; Case/Package: 0402; Case Code (Imperial): 0402; Case Code (Metric): 1005; Contact Plating: Tin,Matte; Min Operating Temperature: -55°C; Max Operating Temperature: 155°C; Tolerance: 1%; Packaging: Tape and Reel; Composition: Thick Film; Package Quantity: 1; Number of Terminations: 2; Termination: SMD/SMT; Voltage Rating (DC): 50V; Features: Moisture Resistant; Military Standard: Not; Working Voltage: 50V; Length: 1mm; Height: 0.016inch; Width: 0.5mm; Depth: 0.5mm; Lead Free: Lead Free; ComponentLink1URL: https://datasheet.ciiva.com/16857/pyu-rc0402-51-rohs-l-6-16857256.pdf?src-supplier=Avnet+Europe; ComponentLink1Description: https://datasheet.ciiva.com/16857/pyu-rc0402-51-rohs-l-6-16857256.pdf?src-supplier=Avnet+Europe; ComponentLink2URL: https://datasheet.ciiva.com/2519/pyu-r-int-thick-7-2519180.pdf?src-supplier=Digi-Key; ComponentLink2Description: https://datasheet.ciiva.com/2519/pyu-r-int-thick-7-2519180.pdf?src-supplier=Digi-Key; ComponentLink3URL: https://datasheet.ciiva.com/2519/pyu-r-int-thick-7-2519181.pdf?src-supplier=Digi-Key; ComponentLink3Description: https://datasheet.ciiva.com/2519/pyu-r-int-thick-7-2519181.pdf?src-supplier=Digi-Key; ComponentLink4URL: https://datasheet.ciiva.com/2519/pyu-r-int-thick-7-2519182.pdf?src-supplier=Digi-Key; ComponentLink4Description: https://datasheet.ciiva.com/2519/pyu-r-int-thick-7-2519182.pdf?src-supplier=Digi-Key; ComponentLink5URL: https://datasheet.ciiva.com/8889/pyu-rc0402-51-rohs-l-6-8889086.pdf?src-supplier=Avnet; ComponentLink5Description: https://datasheet.ciiva.com/8889/pyu-rc0402-51-rohs-l-6-8889086.pdf?src-supplier=Avnet; ComponentLink6URL: https://datasheet.ciiva.com/28399/pyu-rc0402-51-rohs-l-6-28399550.pdf?src-supplier=Avnet+Europe; ComponentLink6Description: https://datasheet.ciiva.com/28399/pyu-rc0402-51-rohs-l-6-28399550.pdf?src-supplier=Avnet+Europe; Supplier 2: Mouser; Supplier Part Number 1: 311-45.3KLRCT-ND; Supplier Part Number 2: 603-RC0402FR-0745K3L
R9 = RC0402FR-0713K3L: RES SMD 13.3K OHM 1% 1/16W 0402; Manufacturer 1: Yageo; Resistance: 13.3kR; Temperature Coefficient: 100ppm/°C; Power Rating: 62.5mW; Voltage Rating: 50V; Max Power Dissipation: 63mW; Manufacturer Part Number 1: RC0402FR-0713K3L; Supplier 1: Digi-Key; Stock 1: 840352; Pricing 1: 1=0.10000, 10=0.01600, 100=0.00640, 1000=0.00289, 2500=0.00251, 5000=0.00207 (USD); RoHS: Yes; Case/Package: 0402; Case Code (Imperial): 0402; Case Code (Metric): 1005; Contact Plating: Tin,Matte; Min Operating Temperature: -55°C; Max Operating Temperature: 155°C; Tolerance: 1%; Packaging: Tape and Reel; Composition: Thick Film; Number of Terminations: 2; Termination: SMD/SMT; Voltage Rating (DC): 50V; Features: Moisture Resistant; Military Standard: Not; Working Voltage: 50V; Length: 1mm; Height: 0.016inch; Width: 0.02inch; Depth: 0.5mm; Lead Free: Lead Free; ComponentLink1URL: https://datasheet.ciiva.com/16869/pyu-rc0402-51-rohs-l-6-16869878.pdf?src-supplier=Avnet+Europe; ComponentLink1Description: https://datasheet.ciiva.com/16869/pyu-rc0402-51-rohs-l-6-16869878.pdf?src-supplier=Avnet+Europe; ComponentLink2URL: https://datasheet.ciiva.com/16741/pyu-rc0402-51-rohs-l-6-r-16741079.pdf?src-supplier=Future+Electronics; ComponentLink2Description: https://datasheet.ciiva.com/16741/pyu-rc0402-51-rohs-l-6-r-16741079.pdf?src-supplier=Future+Electronics; ComponentLink3URL: https://datasheet.ciiva.com/28404/pyu-rc0402-51-rohs-l-6-28404430.pdf?src-supplier=Avnet+Europe; ComponentLink3Description: https://datasheet.ciiva.com/28404/pyu-rc0402-51-rohs-l-6-28404430.pdf?src-supplier=Avnet+Europe; ComponentLink4URL: https://datasheet.ciiva.com/12656/pyu-rc0402-51-rohs-l-6-r-12656623.pdf?src-supplier=Mouser; ComponentLink4Description: https://datasheet.ciiva.com/12656/pyu-rc0402-51-rohs-l-6-r-12656623.pdf?src-supplier=Mouser; Supplier 2: Mouser; Supplier Part Number 1: YAG2974CT-ND; Supplier Part Number 2: 603-RC0402FR-0713K3L
R10 = RC0402FR-0720KL: RES SMD 20K OHM 1% 1/16W 0402 20 kOhms ±1% 0.063W, 1/16W Chip Resistor 0402 (1005 Metric) Moisture Resistant Thick Film; Manufacturer 1: Yageo; Resistance: 20kR; Temperature Coefficient: 100ppm/°C; Power Rating: 62.5mW; Voltage Rating: 50V; Max Power Dissipation: 63mW; Manufacturer Part Number 1: RC0402FR-0720KL; Manufacturer: Yageo; Manufacturer Part Number: RC0402FR-0720KL; RoHS: Yes; Case/Package: 0402; Number of Pins: 2; Case Code (Metric): 1005; Case Code (Imperial): 0402; Min Operating Temperature: -55°C; Max Operating Temperature: 155°C; Tolerance: 1%; Packaging: Tape and Reel; Composition: Thick Film; Military Standard: Not; Number of Terminations: 2; Package Quantity: 1; Voltage Rating (DC): 50V; Termination: SMD/SMT; Features: Moisture Resistant; Length: 1mm; Height: 0.016inch; Width: 0.02inch; Depth: 0.5mm; Lead Free: Lead Free; REACH SVHC: No SVHC; ComponentLink1URL: https://datasheet.ciiva.com/11808/0900766b80c66297-11808454.pdf?src-supplier=RSComponents; ComponentLink1Description: https://datasheet.ciiva.com/11808/0900766b80c66297-11808454.pdf?src-supplier=RSComponents; ComponentLink2URL: https://datasheet.ciiva.com/2453/pyu-r-int-thick-7-2453493.pdf?src-supplier=Digi-Key; ComponentLink2Description: https://datasheet.ciiva.com/2453/pyu-r-int-thick-7-2453493.pdf?src-supplier=Digi-Key; ComponentLink3URL: https://datasheet.ciiva.com/2453/pyu-r-int-thick-7-2453494.pdf?src-supplier=Digi-Key; ComponentLink3Description: https://datasheet.ciiva.com/2453/pyu-r-int-thick-7-2453494.pdf?src-supplier=Digi-Key; ComponentLink4URL: https://datasheet.ciiva.com/2453/pyu-r-int-thick-7-2453495.pdf?src-supplier=Digi-Key; ComponentLink4Description: https://datasheet.ciiva.com/2453/pyu-r-int-thick-7-2453495.pdf?src-supplier=Digi-Key; ComponentLink5URL: https://datasheet.ciiva.com/7983/1018594-7983511.pdf?src-supplier=Element14; ComponentLink5Description: https://datasheet.ciiva.com/7983/1018594-7983511.pdf?src-supplier=Element14; ComponentLink6URL: https://datasheet.ciiva.com/12558/pyu-rc0402-51-rohs-l-6-r-8721-12558796.pdf?src-supplier=Mouser; ComponentLink6Description: https://datasheet.ciiva.com/12558/pyu-rc0402-51-rohs-l-6-r-8721-12558796.pdf?src-supplier=Mouser; ComponentLink7URL: https://datasheet.ciiva.com/46394/1018594-46394974.pdf?src-supplier=Element14; ComponentLink7Description: https://datasheet.ciiva.com/46394/1018594-46394974.pdf?src-supplier=Element14; Supplier 1: Digi-Key; Stock 1: 5326062; Pricing 1: 1=0.10000, 10=0.01600, 100=0.00670, 1000=0.00301, 2500=0.00261, 5000=0.00215 (USD); Supplier Part Number 1: 311-20.0KLRCT-ND
R11 = RC0402FR-0724K9L: RES SMD 24.9K OHM 1% 1/16W 0402; Manufacturer 1: Yageo; Resistance: 24.9kR; Temperature Coefficient: 100ppm/°C; Power Rating: 62.5mW; Voltage Rating: 50V; Max Power Dissipation: 63mW; Manufacturer Part Number 1: RC0402FR-0724K9L; Supplier 1: Digi-Key; Stock 1: 8504078; Pricing 1: 1=0.10000, 10=0.01600, 100=0.00640, 1000=0.00289, 2500=0.00251, 5000=0.00207 (USD); RoHS: Yes; Case/Package: 0402; Case Code (Metric): 1005; Case Code (Imperial): 0402; Contact Plating: Tin,Matte; Min Operating Temperature: -55°C; Max Operating Temperature: 155°C; Tolerance: 1%; Packaging: Tape and Reel; Composition: Thick Film; Package Quantity: 1; Number of Terminations: 2; Termination: SMD/SMT; Voltage Rating (DC): 50V; Features: Moisture Resistant; Military Standard: Not; Length: 1mm; Height: 0.016inch; Width: 0.02inch; Depth: 0.5mm; Lead Free: Lead Free; ComponentLink1URL: https://datasheet.ciiva.com/2519/pyu-r-int-thick-7-2519126.pdf?src-supplier=Digi-Key; ComponentLink1Description: https://datasheet.ciiva.com/2519/pyu-r-int-thick-7-2519126.pdf?src-supplier=Digi-Key; ComponentLink2URL: https://datasheet.ciiva.com/2519/pyu-r-int-thick-7-2519127.pdf?src-supplier=Digi-Key; ComponentLink2Description: https://datasheet.ciiva.com/2519/pyu-r-int-thick-7-2519127.pdf?src-supplier=Digi-Key; ComponentLink3URL: https://datasheet.ciiva.com/2519/pyu-r-int-thick-7-2519128.pdf?src-supplier=Digi-Key; ComponentLink3Description: https://datasheet.ciiva.com/2519/pyu-r-int-thick-7-2519128.pdf?src-supplier=Digi-Key; ComponentLink4URL: https://datasheet.ciiva.com/12667/pyu-rc0402-51-rohs-l-6-r-12667961.pdf?src-supplier=Mouser; ComponentLink4Description: https://datasheet.ciiva.com/12667/pyu-rc0402-51-rohs-l-6-r-12667961.pdf?src-supplier=Mouser; ComponentLink5URL: https://datasheet.ciiva.com/16868/pyu-rc0402-51-rohs-l-6-16868650.pdf?src-supplier=Avnet+Europe; ComponentLink5Description: https://datasheet.ciiva.com/16868/pyu-rc0402-51-rohs-l-6-16868650.pdf?src-supplier=Avnet+Europe; ComponentLink6URL: https://datasheet.ciiva.com/17019/pyu-rc0402-51-rohs-l-6-r-17019690.pdf?src-supplier=Future+Electronics; ComponentLink6Description: https://datasheet.ciiva.com/17019/pyu-rc0402-51-rohs-l-6-r-17019690.pdf?src-supplier=Future+Electronics; ComponentLink7URL: https://datasheet.ciiva.com/8889/pyu-rc0402-51-rohs-l-6-8889995.pdf?src-supplier=Avnet; ComponentLink7Description: https://datasheet.ciiva.com/8889/pyu-rc0402-51-rohs-l-6-8889995.pdf?src-supplier=Avnet; Supplier 2: Mouser; Supplier 3: TTI; Supplier Part Number 1: 311-24.9KLRCT-ND; Supplier Part Number 2: 603-RC0402FR-0724K9L; Supplier Part Number 3: RC0402FR-0724K9L
R12 = CRCW040233K0FKED: RES SMD 33K OHM 1% 1/16W 0402; Manufacturer 1: Vishay; Resistance: 33kR; Power Rating: 63mW; Voltage Rating: 50V; Temperature Coefficient: 100ppm/°C; Manufacturer Part Number 1: CRCW040233K0FKED; Supplier 1: Digi-Key; Stock 1: 59075; Pricing 1: 1=0.10000, 10=0.03800, 100=0.01540, 1000=0.00690, 2500=0.00599, 5000=0.00495 (USD); RoHS: Yes; Case/Package: 0402; Weight: 2.3E-05oz; Case Code (Imperial): 0402; Case Code (Metric): 1005; Min Operating Temperature: -55°C; Max Operating Temperature: 155°C; Tolerance: 1%; Packaging: Tape and Reel; Termination: SMD/SMT; Composition: Thick Film; Military Standard: Not; Voltage Rating (DC): 50V; Length: 1mm; Height: 0.35mm; Width: 0.5mm; Depth: 0.5mm; REACH SVHC: Unknown; Lead Free: Lead Free; ComponentLink1URL: https://datasheet.ciiva.com/11812/0900766b80d98824-11812191.pdf?src-supplier=RSComponents; ComponentLink1Description: https://datasheet.ciiva.com/11812/0900766b80d98824-11812191.pdf?src-supplier=RSComponents; ComponentLink2URL: https://datasheet.ciiva.com/5544/dcrcwe3-109170-5544613.pdf?src-supplier=Mouser; ComponentLink2Description: https://datasheet.ciiva.com/5544/dcrcwe3-109170-5544613.pdf?src-supplier=Mouser; ComponentLink3URL: https://datasheet.ciiva.com/22870/70201119-22870281.pdf?src-supplier=Allied+Electronics; ComponentLink3Description: https://datasheet.ciiva.com/22870/70201119-22870281.pdf?src-supplier=Allied+Electronics; Supplier 2: Newark; Supplier 3: Mouser; Supplier Part Number 1: 541-33.0KLCT-ND; Supplier Part Number 2: 26W9081; Supplier Part Number 3: 71-CRCW040233K0FKED; Mount: Surface Mount; Number of Pins: 2; Contact Plating: Tin; Package Quantity: 10; Number of Terminations: 2; Max Power Dissipation: 63mW; Features: Automotive AEC-Q200; Radiation Hardening: No; ComponentLink4URL: https://datasheet.ciiva.com/2463/dcrcwe3-2463133.pdf?src-supplier=Digi-Key; ComponentLink4Description: https://datasheet.ciiva.com/2463/dcrcwe3-2463133.pdf?src-supplier=Digi-Key; ComponentLink5URL: https://datasheet.ciiva.com/2463/dcrcwe3-2463134.pdf?src-supplier=Digi-Key; ComponentLink5Description: https://datasheet.ciiva.com/2463/dcrcwe3-2463134.pdf?src-supplier=Digi-Key; ComponentLink6URL: https://datasheet.ciiva.com/22674/1847332-22674693.pdf?src-supplier=Element14; ComponentLink6Description: https://datasheet.ciiva.com/22674/1847332-22674693.pdf?src-supplier=Element14; ComponentLink7URL: https://datasheet.ciiva.com/16200/dcrcwe3-16200566.pdf?src-supplier=Future+Electronics; ComponentLink7Description: https://datasheet.ciiva.com/16200/dcrcwe3-16200566.pdf?src-supplier=Future+Electronics; ComponentLink8URL: https://datasheet.ciiva.com/3256/dcrcwe3-3256411.pdf?src-supplier=Avnet; ComponentLink8Description: https://datasheet.ciiva.com/3256/dcrcwe3-3256411.pdf?src-supplier=Avnet; ComponentLink9URL: https://datasheet.ciiva.com/3256/dcrcwe3-3256412.pdf?src-supplier=Avnet; ComponentLink9Description: https://datasheet.ciiva.com/3256/dcrcwe3-3256412.pdf?src-supplier=Avnet; ComponentLink10URL: https://datasheet.ciiva.com/2463/dcrcwe3-2463135.pdf?src-supplier=Digi-Key; ComponentLink10Description: https://datasheet.ciiva.com/2463/dcrcwe3-2463135.pdf?src-supplier=Digi-Key; ComponentLink11URL: https://datasheet.ciiva.com/16772/70201119-16772031.pdf?src-supplier=Allied+Electronics; ComponentLink11Description: https://datasheet.ciiva.com/16772/70201119-16772031.pdf?src-supplier=Allied+Electronics; ComponentLink12URL: https://datasheet.ciiva.com/22704/1697337-22704431.pdf?src-supplier=Element14; ComponentLink12Description: https://datasheet.ciiva.com/22704/1697337-22704431.pdf?src-supplier=Element14
R13 R14 = RC0402FR-0756KL: RES SMD 56K OHM 1% 1/16W 0402 56 kOhms ±1% 0.063W, 1/16W Chip Resistor 0402 (1005 Metric) Moisture Resistant Thick Film; Manufacturer 1: Yageo; Resistance: 56kR; Temperature Coefficient: 100ppm/°C; Power Rating: 62.5mW; Voltage Rating: 50V; Max Power Dissipation: 63mW; Manufacturer Part Number 1: RC0402FR-0756KL; Manufacturer: Yageo; Manufacturer Part Number: RC0402FR-0756KL; RoHS: Yes; Case/Package: 0402; Case Code (Metric): 1005; Case Code (Imperial): 0402; Min Operating Temperature: -55°C; Max Operating Temperature: 155°C; Tolerance: 1%; Packaging: Tape and Reel; Composition: Thick Film; Package Quantity: 1; Number of Terminations: 2; Termination: SMD/SMT; Military Standard: Not; Features: Moisture Resistant; Working Voltage: 50V; Length: 1mm; Height: 0.016inch; Width: 0.02inch; Depth: 0.5mm; Lead Free: Lead Free; REACH SVHC: No SVHC; ComponentLink1URL: https://datasheet.ciiva.com/2453/pyu-r-int-thick-7-2453478.pdf?src-supplier=Digi-Key; ComponentLink1Description: https://datasheet.ciiva.com/2453/pyu-r-int-thick-7-2453478.pdf?src-supplier=Digi-Key; ComponentLink2URL: https://datasheet.ciiva.com/2453/pyu-r-int-thick-7-2453479.pdf?src-supplier=Digi-Key; ComponentLink2Description: https://datasheet.ciiva.com/2453/pyu-r-int-thick-7-2453479.pdf?src-supplier=Digi-Key; ComponentLink3URL: https://datasheet.ciiva.com/5558/pyu-rc0402-51-rohs-l-6-r-5558279.pdf?src-supplier=Mouser; ComponentLink3Description: https://datasheet.ciiva.com/5558/pyu-rc0402-51-rohs-l-6-r-5558279.pdf?src-supplier=Mouser; ComponentLink4URL: https://datasheet.ciiva.com/2453/pyu-r-int-thick-7-2453480.pdf?src-supplier=Digi-Key; ComponentLink4Description: https://datasheet.ciiva.com/2453/pyu-r-int-thick-7-2453480.pdf?src-supplier=Digi-Key; ComponentLink5URL: https://datasheet.ciiva.com/46412/1018594-46412840.pdf?src-supplier=Element14; ComponentLink5Description: https://datasheet.ciiva.com/46412/1018594-46412840.pdf?src-supplier=Element14; ComponentLink6URL: https://datasheet.ciiva.com/7850/1018594-7850044.pdf?src-supplier=Element14; ComponentLink6Description: https://datasheet.ciiva.com/7850/1018594-7850044.pdf?src-supplier=Element14; ComponentLink7URL: https://datasheet.ciiva.com/7850/1018594-7850045.pdf?src-supplier=Element14; ComponentLink7Description: https://datasheet.ciiva.com/7850/1018594-7850045.pdf?src-supplier=Element14; Supplier 1: Digi-Key; Stock 1: 1721730; Pricing 1: 1=0.10000, 10=0.01600, 100=0.00670, 1000=0.00301, 2500=0.00261, 5000=0.00215 (USD); Supplier Part Number 1: 311-56.0KLRCT-ND
R29 = CRCW06030000Z0EA: RES SMD 0 OHM JUMPER 1/10W 0603 0 Ohms Jumper 0.1W, 1/10W Chip Resistor 0603 (1608 Metric) Automotive AEC-Q200 Thick Film; Manufacturer 1: Vishay; Manufacturer Part Number 1: CRCW0603-0000Z0EA; Resistance: 0mR; Power Rating: 100mW; Voltage Rating: 75V; Temperature Coefficient: 100ppm/°C; Tolerance: 5%; Current Rating: 2A; Supplier 1: Digi-Key; Stock 1: 742743; Pricing 1: 1=0.100000, 10=0.034000, 25=0.024400, 50=0.018600, 100=0.013800, 250=0.010480, 500=0.008400, 1000=0.006180 (USD); RoHS: Yes; Mount: Surface Mount; Case/Package: 0603; Weight: 7.1E-05oz; Contact Plating: Tin,Lead; Case Code (Metric): 1608; Case Code (Imperial): 0603; Min Operating Temperature: -55°C; Max Operating Temperature: 155°C; Composition: Thick Film; Termination: SMD/SMT; Packaging: Tape and Reel; Package Quantity: 1; Number of Terminations: 2; Military Standard: Not; Max Power Dissipation: 100mW; Voltage Rating (DC): 75V; Features: Automotive AEC-Q200; Working Voltage: 75V; Length: 1.55mm; Height: 0.02inch; Width: 0.033inch; Depth: 0.85mm; Radiation Hardening: No; Lead Free: Lead Free; REACH SVHC: Unknown; ComponentLink1URL: https://datasheet.ciiva.com/2461/dcrcwe3-2461968.pdf?src-supplier=Digi-Key; ComponentLink1Description: https://datasheet.ciiva.com/2461/dcrcwe3-2461968.pdf?src-supplier=Digi-Key; ComponentLink2URL: https://datasheet.ciiva.com/2461/dcrcwe3-2461969.pdf?src-supplier=Digi-Key; ComponentLink2Description: https://datasheet.ciiva.com/2461/dcrcwe3-2461969.pdf?src-supplier=Digi-Key; ComponentLink3URL: https://datasheet.ciiva.com/2461/dcrcwe3-2461970.pdf?src-supplier=Digi-Key; ComponentLink3Description: https://datasheet.ciiva.com/2461/dcrcwe3-2461970.pdf?src-supplier=Digi-Key; ComponentLink4URL: https://datasheet.ciiva.com/8340/dcrcwe3-8340197.pdf?src-supplier=Avnet; ComponentLink4Description: https://datasheet.ciiva.com/8340/dcrcwe3-8340197.pdf?src-supplier=Avnet; ComponentLink5URL: https://datasheet.ciiva.com/16941/dcrcw-16941302.pdf?src-supplier=Avnet+Europe; ComponentLink5Description: https://datasheet.ciiva.com/16941/dcrcw-16941302.pdf?src-supplier=Avnet+Europe; ComponentLink6URL: https://datasheet.ciiva.com/16199/dcrcwe3-16199063.pdf?src-supplier=Future+Electronics; ComponentLink6Description: https://datasheet.ciiva.com/16199/dcrcwe3-16199063.pdf?src-supplier=Future+Electronics; ComponentLink7URL: https://datasheet.ciiva.com/16725/70201119-16725175.pdf?src-supplier=Allied+Electronics; ComponentLink7Description: https://datasheet.ciiva.com/16725/70201119-16725175.pdf?src-supplier=Allied+Electronics; ComponentLink8URL: https://datasheet.ciiva.com/26316/fld-crcw-e3-data-en-26316615.pdf?src-supplier=Distrelec; ComponentLink8Description: https://datasheet.ciiva.com/26316/fld-crcw-e3-data-en-26316615.pdf?src-supplier=Distrelec; ComponentLink9URL: https://datasheet.ciiva.com/5544/dcrcwe3-109170-5544344.pdf?src-supplier=Mouser; ComponentLink9Description: https://datasheet.ciiva.com/5544/dcrcwe3-109170-5544344.pdf?src-supplier=Mouser; ComponentLink10URL: https://datasheet.ciiva.com/7841/1720486-7841816.pdf?src-supplier=Element14; ComponentLink10Description: https://datasheet.ciiva.com/7841/1720486-7841816.pdf?src-supplier=Element14; ComponentLink11URL: https://datasheet.ciiva.com/7841/1720486-7841817.pdf?src-supplier=Element14; ComponentLink11Description: https://datasheet.ciiva.com/7841/1720486-7841817.pdf?src-supplier=Element14; ComponentLink12URL: https://datasheet.ciiva.com/7841/125364-7841818.pdf?src-supplier=Element14; ComponentLink12Description: https://datasheet.ciiva.com/7841/125364-7841818.pdf?src-supplier=Element14; ComponentLink13URL: https://datasheet.ciiva.com/16721/70201119-16721450.pdf?src-supplier=Allied+Electronics; ComponentLink13Description: https://datasheet.ciiva.com/16721/70201119-16721450.pdf?src-supplier=Allied+Electronics; Supplier Part Number 1: 541-0.0GCT-ND
R30 = RC0402FR-071KL: RES SMD 1K OHM 1% 1/16W 0402 1 kOhms ±1% 0.063W, 1/16W Chip Resistor 0402 (1005 Metric) Moisture Resistant Thick Film; Manufacturer 1: Yageo; Temperature Coefficient: 100ppm/°C; Power Rating: 62.5mW; Voltage Rating (DC): 50V; Resistance: 1kR; Manufacturer Part Number 1: RC0402FR-071KL; RoHS: Yes; Number of Pins: 2; Case Code (Imperial): 0402; Case Code (Metric): 1005; Min Operating Temperature: -55°C; Max Operating Temperature: 155°C; Packaging: Tape and Reel; Composition: Thick Film; Voltage Rating: 50V; Military Standard: Not; Termination: SMD/SMT; Length: 1mm; Height: 0.32mm; Width: 0.5mm; Depth: 0.5mm; Lead Free: Lead Free; REACH SVHC: Unknown; ComponentLink1URL: https://datasheet.ciiva.com/11819/0900766b80c66297-11819477.pdf?src-supplier=RSComponents; ComponentLink1Description: https://datasheet.ciiva.com/11819/0900766b80c66297-11819477.pdf?src-supplier=RSComponents; ComponentLink2URL: https://datasheet.ciiva.com/12666/pyu-rc0402-51-rohs-l-6-r-12666741.pdf?src-supplier=Mouser; ComponentLink2Description: https://datasheet.ciiva.com/12666/pyu-rc0402-51-rohs-l-6-r-12666741.pdf?src-supplier=Mouser; ComponentLink3URL: https://datasheet.ciiva.com/17063/pyu-rc0402-51-rohs-l-6-r-17063193.pdf?src-supplier=Future+Electronics; ComponentLink3Description: https://datasheet.ciiva.com/17063/pyu-rc0402-51-rohs-l-6-r-17063193.pdf?src-supplier=Future+Electronics; ComponentLink4URL: https://datasheet.ciiva.com/22747/1018594-22747513.pdf?src-supplier=Element14; ComponentLink4Description: https://datasheet.ciiva.com/22747/1018594-22747513.pdf?src-supplier=Element14; ComponentLink5URL: https://datasheet.ciiva.com/7849/1018594-7849869.pdf?src-supplier=Element14; ComponentLink5Description: https://datasheet.ciiva.com/7849/1018594-7849869.pdf?src-supplier=Element14; ComponentLink6URL: https://datasheet.ciiva.com/7983/1018594-7983502.pdf?src-supplier=Element14; ComponentLink6Description: https://datasheet.ciiva.com/7983/1018594-7983502.pdf?src-supplier=Element14; ComponentLink7URL: https://datasheet.ciiva.com/7849/1018594-7849871.pdf?src-supplier=Element14; ComponentLink7Description: https://datasheet.ciiva.com/7849/1018594-7849871.pdf?src-supplier=Element14; Supplier 1: Digi-Key; Stock 1: 60695854; Pricing 1: 1=0.10000, 10=0.01600, 100=0.00670, 1000=0.00301, 2500=0.00261, 5000=0.00215 (USD); Case/Package: 0402; Tolerance: 1%; Supplier Part Number 1: 311-1.00KLRCT-ND